# Altium schematic sheet Interface - CAN.SchDoc
size A; SheetNumber: 6; SheetTotal: 11
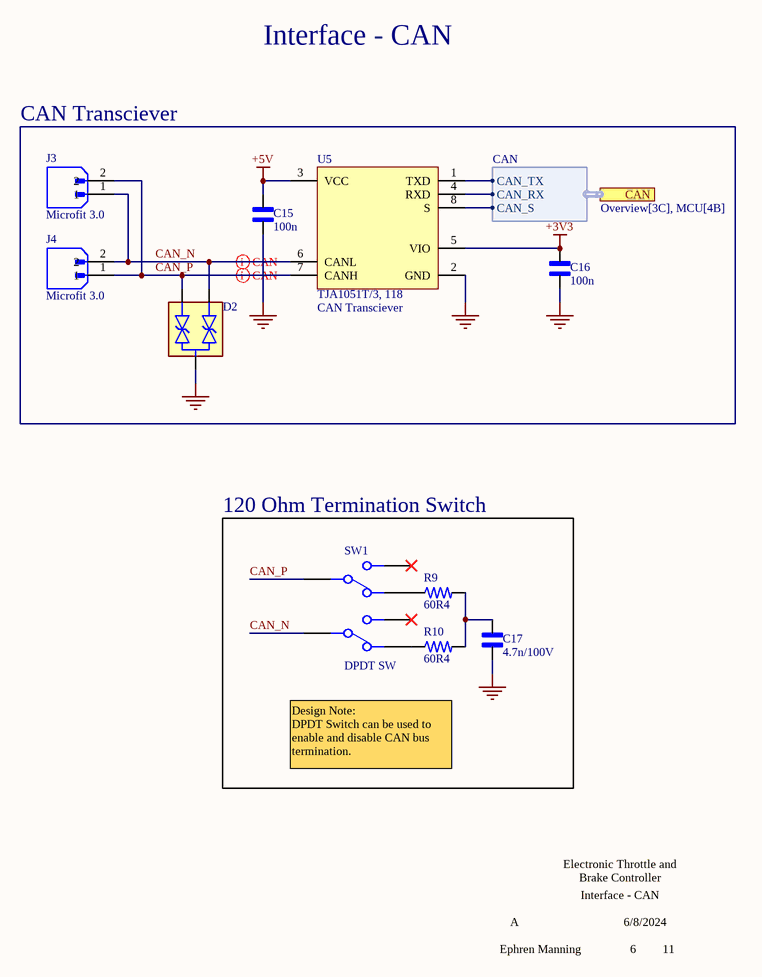
[diagram p0: Interface - CAN.SchDoc]

## Parts
C15  100n  [CAP_0402-Footprint-1]
C16  100n  [CAP_0402-Footprint-1]
C17  4.7n/100V  [CAP_0402-Footprint-1]
D2  ESD2CANFD24DBZRQ1  [SOT95P237X112-3N]  (value not drawn)
J3  Microfit 3.0  [MOLEX_436500216]
J4  Microfit 3.0  [MOLEX_436500216]
R9  60R4  [RES_0402-Footprint-1]
R10  60R4  [RES_0402-Footprint-1]
SW1  DPDT SW  [SW_JS202011JCQN]
U5  TJA1051T/3, 118  [SOIC127P600X175-8N]

## Blocks framed on the sheet
CAN Transciever: C15 C16 D2 J3 J4 U5
120 Ohm Termination Switch: C17 R9 R10 SW1

## Ports
CAN (harness CAN, see Overview[3C], MCU[4B])

## Harnesses
CAN: CAN_TX, CAN_RX, CAN_S

## Nets
+3V3: C16.2 U5.5(VIO)
+5V: C15.2 U5.3(VCC)
GND: C15.1 C16.1 C17.1 D2.3(GND) U5.2(GND)
CAN_N: D2.1(IO1) J3.1 J4.2 SW1.6 U5.6(CANL)
CAN_P: D2.2(IO2) J3.2 J4.1 SW1.2 U5.7(CANH)
NetC17_2: C17.2 R9.2 R10.2
NetR9_1: R9.1 SW1.3
NetR10_1: R10.1 SW1.7
NetU5_1: U5.1(TXD) ; port CAN.CAN_TX
NetU5_4: U5.4(RXD) ; port CAN.CAN_RX
NetU5_8: U5.8(S) ; port CAN.CAN_S

Not connected (* = marked no-connect by the designer): SW1 1* 5*

## Layout directives
differential pair: CAN_N, CAN_P

## Notes on the sheet
- Interface - CAN
- (near U5) CAN Transciever
- Design Note:
  DPDT Switch can be used to enable and disable CAN bus termination.
- Electronic Throttle and
  Brake Controller
- A
- 6/8/2024
- Ephren Manning
- 6
- 11
- Project Title:
- Sheet Title:
- Revision:
- Date:
- Author:
- Sheet        of

## Library data of the parts
C15 C16 = CMP-00066-3: 100nF 10V 10% 0402 CAP; Manufacturer Part Number 1: CL05B104KP5NNNC; Manufacturer 1: Samsung Electro-Mechanics; Digikey Part Number: 1276-1002-1-ND
C17 = CMP-00072-1: 4.7nF 100V 10% 0402 Ceramic Capacitor; Manufacturer 1: Murata Electronics; Manufacturer Part Number 1: GCM155R72A472KA37D; Digikey Part Number: 490-4765-1-ND
D2 = CMP-112-000000-3: Dual TVS Protection Diodes; Manufacturer 1: Texas Instruments; Digikey Part Number: 296-ESD2CANFD24DBZRQ1CT-ND; Manufacturer Part number 1: ESD2CANFD24DBZRQ1
J3 J4 = CMP-085-000002-2: 1x2 Gold Microfit; Manufacturer Part Number 1: 43650-0216; Manufacturer 1: Molex; Digikey Part Number: WM1922-ND
R9 R10 = CMP-00071-1: 60.4 Ohm 1% 1/16W 0402 Resistor; Manufacturer Part Number 1: RC0402FR-0760R4L; Manufacturer 1: YAGEO; Digikey Part Number: 311-60.4LRCT-ND
SW1 = CMP-114-000000-2: DPDT SMD SWITCH 6V 300MA; Manufacturer 1: C&K; Manufacturer Part Number 1: JS202011JCQN; Digikey Part Number: CKN10723CT-ND
U5 = CMP-00010-11: CAN Transceiver, NXP; Manufacturer 1: NXP USA Inc.; Manufacturer Part Number 1: TJA1051T/3,118; Digikey Part Number: 568-8684-1-ND